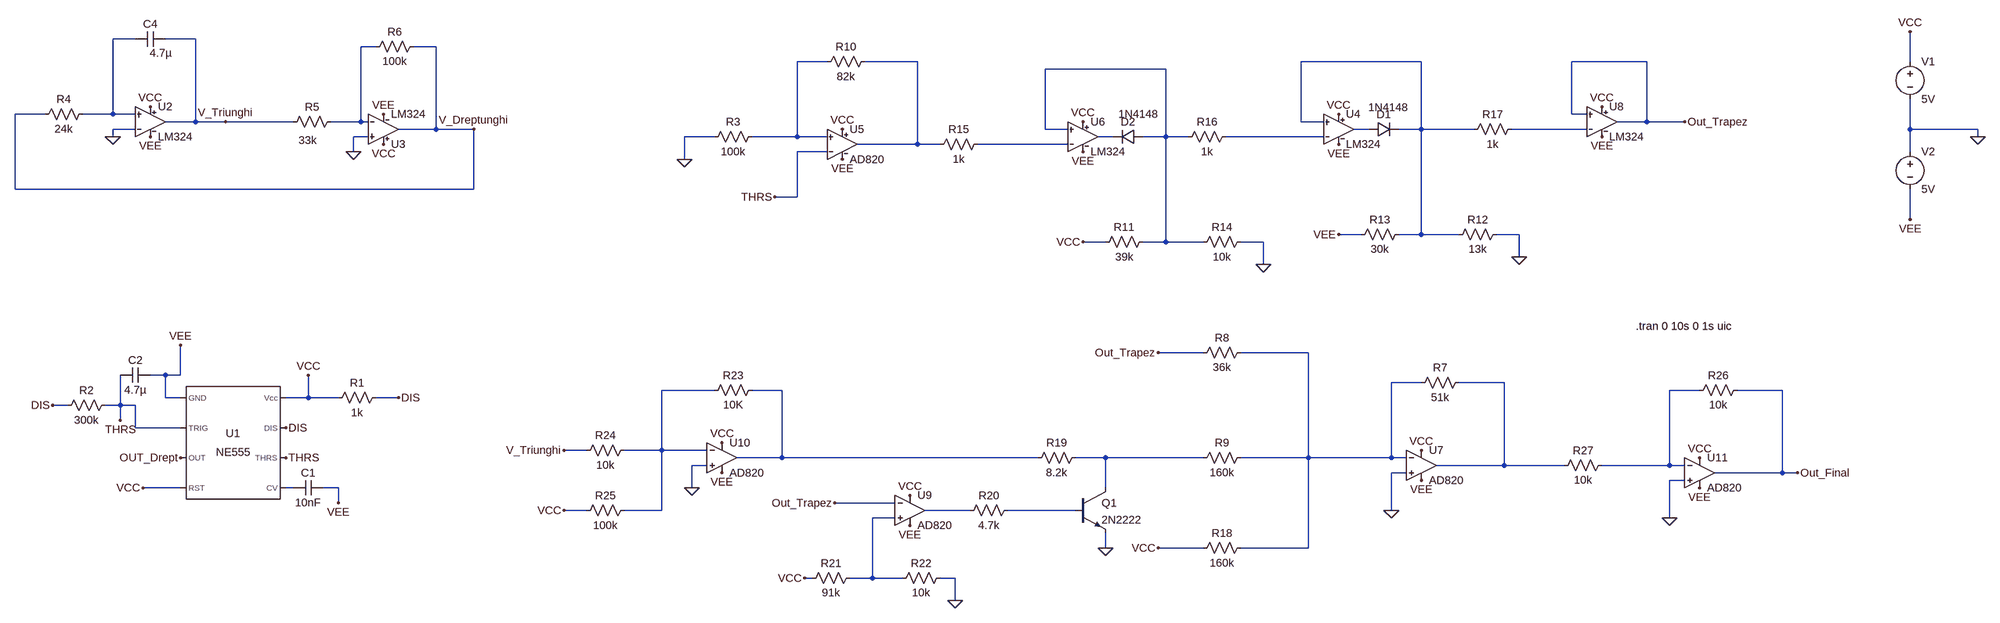
[diagram p0: schematic bun.asc]
bun.asc, the LTspice schematic file:
Version 4.1
SHEET 1 1480 1000
WIRE -2912 -992 -2960 -992
WIRE -2784 -992 -2848 -992
WIRE -2400 -976 -2432 -976
WIRE -2272 -976 -2320 -976
WIRE -1440 -944 -1504 -944
WIRE -1248 -944 -1360 -944
WIRE -176 -944 -432 -944
WIRE 304 -944 144 -944
WIRE 1312 -944 1312 -1008
WIRE -720 -928 -976 -928
WIRE -3104 -832 -3168 -832
WIRE -2960 -832 -2960 -992
WIRE -2960 -832 -3024 -832
WIRE -2912 -832 -2960 -832
WIRE 144 -832 144 -944
WIRE 176 -832 144 -832
WIRE -2784 -816 -2784 -992
WIRE -2784 -816 -2848 -816
WIRE -2720 -816 -2784 -816
WIRE -2576 -816 -2720 -816
WIRE -2432 -816 -2432 -976
WIRE -2432 -816 -2496 -816
WIRE -2416 -816 -2432 -816
WIRE -432 -816 -432 -944
WIRE -384 -816 -432 -816
WIRE 304 -816 304 -944
WIRE 304 -816 240 -816
WIRE 384 -816 304 -816
WIRE -2912 -800 -2960 -800
WIRE -2272 -800 -2272 -976
WIRE -2272 -800 -2352 -800
WIRE -2192 -800 -2272 -800
WIRE -976 -800 -976 -928
WIRE -928 -800 -976 -800
WIRE -288 -800 -320 -800
WIRE -176 -800 -176 -944
WIRE -176 -800 -224 -800
WIRE -64 -800 -176 -800
WIRE 176 -800 16 -800
WIRE 1312 -800 1312 -864
WIRE 1456 -800 1312 -800
WIRE -2960 -784 -2960 -800
WIRE -2416 -784 -2448 -784
WIRE -1680 -784 -1744 -784
WIRE -1504 -784 -1504 -944
WIRE -1504 -784 -1600 -784
WIRE -1440 -784 -1504 -784
WIRE -832 -784 -864 -784
WIRE -720 -784 -720 -928
WIRE -720 -784 -768 -784
WIRE -672 -784 -720 -784
WIRE -384 -784 -592 -784
WIRE 1456 -784 1456 -800
WIRE -1248 -768 -1248 -944
WIRE -1248 -768 -1376 -768
WIRE -1200 -768 -1248 -768
WIRE -928 -768 -1120 -768
WIRE -2448 -752 -2448 -784
WIRE -1440 -752 -1504 -752
WIRE 1312 -752 1312 -800
WIRE -1744 -736 -1744 -784
WIRE -3168 -672 -3168 -832
WIRE -2192 -672 -2192 -800
WIRE -2192 -672 -3168 -672
WIRE -1504 -656 -1504 -752
WIRE -1504 -656 -1552 -656
WIRE 1312 -608 1312 -672
WIRE -304 -576 -352 -576
WIRE -176 -576 -176 -800
WIRE -176 -576 -224 -576
WIRE -96 -576 -176 -576
WIRE 32 -576 -16 -576
WIRE -848 -560 -896 -560
WIRE -720 -560 -720 -784
WIRE -720 -560 -768 -560
WIRE -640 -560 -720 -560
WIRE -512 -560 -560 -560
WIRE 32 -528 32 -576
WIRE -512 -512 -512 -560
WIRE -640 -256 -736 -256
WIRE -416 -256 -560 -256
WIRE -2848 -208 -2880 -208
WIRE -2816 -208 -2816 -272
WIRE -2816 -208 -2848 -208
WIRE -176 -192 -240 -192
WIRE 0 -192 -96 -192
WIRE -1680 -176 -1792 -176
WIRE -1536 -176 -1600 -176
WIRE 416 -176 352 -176
WIRE 592 -176 496 -176
WIRE -2848 -160 -2848 -208
WIRE -2816 -160 -2848 -160
WIRE -2544 -160 -2544 -208
WIRE -2544 -160 -2592 -160
WIRE -2480 -160 -2544 -160
WIRE -2352 -160 -2400 -160
WIRE -3056 -144 -3088 -144
WIRE -2944 -144 -2944 -208
WIRE -2944 -144 -2976 -144
WIRE -2912 -144 -2944 -144
WIRE -2944 -112 -2944 -144
WIRE -2912 -96 -2912 -144
WIRE -2816 -96 -2912 -96
WIRE -1952 -48 -2000 -48
WIRE -1792 -48 -1792 -176
WIRE -1792 -48 -1872 -48
WIRE -1696 -48 -1792 -48
WIRE -1536 -32 -1536 -176
WIRE -1536 -32 -1632 -32
WIRE -992 -32 -1536 -32
WIRE -848 -32 -912 -32
WIRE -640 -32 -848 -32
WIRE -416 -32 -416 -256
WIRE -416 -32 -560 -32
WIRE -240 -32 -240 -192
WIRE -240 -32 -416 -32
WIRE -208 -32 -240 -32
WIRE -1696 -16 -1728 -16
WIRE 0 -16 0 -192
WIRE 0 -16 -144 -16
WIRE 128 -16 0 -16
WIRE 352 -16 352 -176
WIRE 352 -16 208 -16
WIRE 384 -16 352 -16
WIRE -208 0 -240 0
WIRE 592 0 592 -176
WIRE 592 0 448 0
WIRE 624 0 592 0
WIRE 384 16 352 16
WIRE -2816 32 -2896 32
WIRE -2576 32 -2592 32
WIRE -2480 32 -2512 32
WIRE -1728 32 -1728 -16
WIRE -848 32 -848 -32
WIRE -2480 64 -2480 32
WIRE -1296 64 -1424 64
WIRE -1952 80 -2000 80
WIRE -1792 80 -1792 -48
WIRE -1792 80 -1872 80
WIRE -1136 80 -1232 80
WIRE -912 80 -1056 80
WIRE -240 80 -240 0
WIRE -1296 96 -1344 96
WIRE 352 96 352 16
WIRE -848 160 -848 128
WIRE -640 160 -736 160
WIRE -416 160 -416 -32
WIRE -416 160 -560 160
WIRE -1472 224 -1488 224
WIRE -1344 224 -1344 96
WIRE -1344 224 -1392 224
WIRE -1280 224 -1344 224
WIRE -1168 224 -1200 224
WIRE -1168 272 -1168 224
FLAG 1456 -784 0
FLAG 1312 -1008 VCC
FLAG -2544 -208 VCC
FLAG -2896 32 VCC
FLAG -2352 -160 DIS
FLAG -2592 -96 DIS
FLAG -3088 -144 DIS
FLAG -2592 -32 THRS
FLAG -2944 -112 THRS
FLAG -2816 -32 OUT_Drept
FLAG 1312 -608 VEE
FLAG -2880 -848 VCC
FLAG -2880 -784 VEE
FLAG -2384 -768 VCC
FLAG -2960 -784 0
FLAG -2720 -816 V_Triunghi
FLAG -2192 -800 V_Dreptunghi
FLAG -2448 -752 0
FLAG -2384 -832 VEE
FLAG -1408 -800 VCC
FLAG -1408 -736 VEE
FLAG -1552 -656 THRS
FLAG -1744 -736 0
FLAG -512 -512 0
FLAG -896 -560 VCC
FLAG -896 -816 VCC
FLAG -896 -752 VEE
FLAG -2816 -272 VEE
FLAG 384 -816 Out_Trapez
FLAG 32 -528 0
FLAG -352 -832 VCC
FLAG -352 -768 VEE
FLAG -352 -576 VEE
FLAG 208 -848 VCC
FLAG 208 -784 VEE
FLAG -240 80 0
FLAG -176 16 VEE
FLAG 624 0 Out_Final
FLAG -2480 64 VEE
FLAG -848 160 0
FLAG -1424 64 Out_Trapez
FLAG -1168 272 0
FLAG -1264 48 VCC
FLAG -1264 112 VEE
FLAG -1488 224 VCC
FLAG -2000 -48 V_Triunghi
FLAG -1664 -64 VCC
FLAG -1664 0 VEE
FLAG -1728 32 0
FLAG 352 96 0
FLAG 416 -32 VCC
FLAG 416 32 VEE
FLAG -2000 80 VCC
FLAG -176 -48 VCC
FLAG -736 160 VCC
FLAG -736 -256 Out_Trapez
SYMBOL Misc\\NE555 -2704 -64 R0
SYMATTR InstName U1
SYMBOL voltage 1312 -960 R0
SYMATTR InstName V1
SYMATTR Value 5V
SYMBOL cap -2512 16 R90
WINDOW 0 0 32 VBottom 2
WINDOW 3 32 32 VTop 2
SYMATTR InstName C1
SYMATTR Value 10nF
SYMBOL res -2384 -176 R90
WINDOW 0 0 56 VBottom 2
WINDOW 3 32 56 VTop 2
SYMATTR InstName R1
SYMATTR Value 1k
SYMBOL res -2960 -160 R90
WINDOW 0 0 56 VBottom 2
WINDOW 3 32 56 VTop 2
SYMATTR InstName R2
SYMATTR Value 300k
SYMBOL cap -2880 -224 R90
WINDOW 0 0 32 VBottom 2
WINDOW 3 32 32 VTop 2
SYMATTR InstName C2
SYMATTR Value 4.7µ
SYMBOL voltage 1312 -768 R0
SYMATTR InstName V2
SYMATTR Value 5V
SYMBOL cap -2848 -1008 R90
WINDOW 0 0 32 VBottom 2
WINDOW 3 30 10 VTop 2
SYMATTR InstName C4
SYMATTR Value 4.7µ
SYMBOL res -3008 -848 R90
WINDOW 0 0 56 VBottom 2
WINDOW 3 32 56 VTop 2
SYMATTR InstName R4
SYMATTR Value 24k
SYMBOL res -2480 -832 R90
WINDOW 0 0 56 VBottom 2
WINDOW 3 40 65 VTop 2
SYMATTR InstName R5
SYMATTR Value 33k
SYMBOL res -2304 -992 R90
WINDOW 0 0 56 VBottom 2
WINDOW 3 32 56 VTop 2
SYMATTR InstName R6
SYMATTR Value 100k
SYMBOL res -1584 -800 R90
WINDOW 0 0 56 VBottom 2
WINDOW 3 32 56 VTop 2
SYMATTR InstName R3
SYMATTR Value 100k
SYMBOL res -1344 -960 R90
WINDOW 0 0 56 VBottom 2
WINDOW 3 32 56 VTop 2
SYMATTR InstName R10
SYMATTR Value 82k
SYMBOL res -544 -576 R90
WINDOW 0 0 56 VBottom 2
WINDOW 3 32 56 VTop 2
SYMATTR InstName R14
SYMATTR Value 10k
SYMBOL res -1104 -784 R90
WINDOW 0 0 56 VBottom 2
WINDOW 3 32 56 VTop 2
SYMATTR InstName R15
SYMATTR Value 1k
SYMBOL diode -768 -800 R90
WINDOW 0 0 32 VBottom 2
WINDOW 3 -48 10 VTop 2
SYMATTR InstName D2
SYMATTR Value 1N4148
SYMBOL res -752 -576 R90
WINDOW 0 0 56 VBottom 2
WINDOW 3 32 56 VTop 2
SYMATTR InstName R11
SYMATTR Value 39k
SYMBOL res 0 -592 R90
WINDOW 0 0 56 VBottom 2
WINDOW 3 32 56 VTop 2
SYMATTR InstName R12
SYMATTR Value 13k
SYMBOL diode -288 -784 R270
WINDOW 0 32 32 VTop 2
WINDOW 3 78 42 VBottom 2
SYMATTR InstName D1
SYMATTR Value 1N4148
SYMBOL res -208 -592 R90
WINDOW 0 0 56 VBottom 2
WINDOW 3 32 56 VTop 2
SYMATTR InstName R13
SYMATTR Value 30k
SYMBOL res -576 -800 R90
WINDOW 0 0 56 VBottom 2
WINDOW 3 32 56 VTop 2
SYMATTR InstName R16
SYMATTR Value 1k
SYMBOL res 32 -816 R90
WINDOW 0 0 56 VBottom 2
WINDOW 3 32 56 VTop 2
SYMATTR InstName R17
SYMATTR Value 1k
SYMBOL LM324 -1408 -832 R0
SYMATTR InstName U5
SYMATTR Value AD820
SYMBOL LM324 -896 -848 R0
SYMATTR InstName U6
SYMBOL LM324 -352 -864 R0
SYMATTR InstName U4
SYMBOL LM324 208 -880 R0
SYMATTR InstName U8
SYMBOL res -80 -208 R90
WINDOW 0 0 56 VBottom 2
WINDOW 3 32 56 VTop 2
SYMATTR InstName R7
SYMATTR Value 51k
SYMBOL res -544 -272 R90
WINDOW 0 0 56 VBottom 2
WINDOW 3 32 56 VTop 2
SYMATTR InstName R8
SYMATTR Value 36k
SYMBOL res -544 144 R90
WINDOW 0 0 56 VBottom 2
WINDOW 3 32 56 VTop 2
SYMATTR InstName R18
SYMATTR Value 160k
SYMBOL LM324 -2880 -880 R0
SYMATTR InstName U2
SYMBOL LM324 -2384 -736 M180
SYMATTR InstName U3
SYMBOL res -1040 64 R90
WINDOW 0 0 56 VBottom 2
WINDOW 3 32 56 VTop 2
SYMATTR InstName R20
SYMATTR Value 4.7k
SYMBOL res -1376 208 R90
WINDOW 0 0 56 VBottom 2
WINDOW 3 32 56 VTop 2
SYMATTR InstName R21
SYMATTR Value 91k
SYMBOL res -1184 208 R90
WINDOW 0 0 56 VBottom 2
WINDOW 3 32 56 VTop 2
SYMATTR InstName R22
SYMATTR Value 10k
SYMBOL OpAmps\\AD820 -176 -80 R0
SYMATTR InstName U7
SYMBOL npn -912 32 R0
SYMATTR InstName Q1
SYMATTR Value 2N2222
SYMBOL res -544 -48 R90
WINDOW 0 0 56 VBottom 2
WINDOW 3 32 56 VTop 2
SYMATTR InstName R9
SYMATTR Value 160k
SYMBOL res -896 -48 R90
WINDOW 0 0 56 VBottom 2
WINDOW 3 32 56 VTop 2
SYMATTR InstName R19
SYMATTR Value 8.2k
SYMBOL OpAmps\\AD820 -1664 -96 R0
SYMATTR InstName U10
SYMBOL res -1584 -192 R90
WINDOW 0 0 56 VBottom 2
WINDOW 3 32 56 VTop 2
SYMATTR InstName R23
SYMATTR Value 10K
SYMBOL res -1856 -64 R90
WINDOW 0 0 56 VBottom 2
WINDOW 3 32 56 VTop 2
SYMATTR InstName R24
SYMATTR Value 10k
SYMBOL res -1856 64 R90
WINDOW 0 0 56 VBottom 2
WINDOW 3 32 56 VTop 2
SYMATTR InstName R25
SYMATTR Value 100k
SYMBOL res 512 -192 R90
WINDOW 0 0 56 VBottom 2
WINDOW 3 32 56 VTop 2
SYMATTR InstName R26
SYMATTR Value 10k
SYMBOL OpAmps\\AD820 416 -64 R0
SYMATTR InstName U11
SYMBOL res 224 -32 R90
WINDOW 0 0 56 VBottom 2
WINDOW 3 32 56 VTop 2
SYMATTR InstName R27
SYMATTR Value 10k
SYMBOL OpAmps\\AD820 -1264 16 R0
SYMATTR InstName U9
TEXT 280 -312 Left 2 !.tran 0 10s 0 1s uic

The netlist it stands for:
* bun.asc
X§U1 VEE THRS OUT_Drept VCC N018 THRS DIS VCC NE555  ; pins GND TRIG OUT RST CV THRS DIS Vcc
V1 VCC 0 5V
C1 VEE N018 10nF
R1 DIS VCC 1k
R2 THRS DIS 300k
C2 VEE THRS 4.7µ
V2 0 VEE 5V
C4 V_Triunghi N001 4.7µ
R4 N001 V_Dreptunghi 24k
R5 N002 V_Triunghi 33k
R6 V_Dreptunghi N002 100k
R3 N003 0 100k
R10 N004 N003 82k
R14 0 N006 10k
R15 N011 N004 1k
D2 N006 N009 1N4148
R11 N006 VCC 39k
R12 0 N005 13k
D1 N007 N005 1N4148
R13 N005 VEE 30k
R16 N010 N006 1k
R17 N008 N005 1k
X§U5 THRS N003 VCC VEE N004 AD820  ; pins In+ In- V+ V- OUT
X§U6 N011 N006 VCC VEE N009 LM324  ; pins In+ In- V+ V- OUT
X§U4 N010 N005 VCC VEE N007 LM324  ; pins In+ In- V+ V- OUT
X§U8 N008 Out_Trapez VCC VEE Out_Trapez LM324  ; pins In+ In- V+ V- OUT
R7 N013 N012 51k
R8 N012 Out_Trapez 36k
R18 N012 VCC 160k
X§U2 0 N001 VCC VEE V_Triunghi LM324  ; pins In+ In- V+ V- OUT
X§U3 N002 0 VCC VEE V_Dreptunghi LM324  ; pins In+ In- V+ V- OUT
R20 N020 N019 4.7k
R21 N021 VCC 91k
R22 0 N021 10k
X§U7 0 N012 VCC VEE N013 AD820  ; pins In+ In- V+ V- OUT
Q1 N017 N020 0 0 2N2222
R9 N012 N017 160k
R19 N017 N015 8.2k
X§U10 0 N014 VCC VEE N015 AD820  ; pins In+ In- V+ V- OUT
R23 N015 N014 10K
R24 N014 V_Triunghi 10k
R25 N014 VCC 100k
R26 Out_Final N016 10k
X§U11 0 N016 VCC VEE Out_Final AD820  ; pins In+ In- V+ V- OUT
R27 N016 N013 10k
X§U9 N021 Out_Trapez VCC VEE N019 AD820  ; pins In+ In- V+ V- OUT
.model D D
.lib standard.dio
.model NPN NPN
.model PNP PNP
.lib standard.bjt
.tran 0 10s 0 1s uic
.lib NE555.sub
.lib LM324.lib
.backanno
.end